# EAGLE design USB Power Distribution (EAGLE 9.4.2)
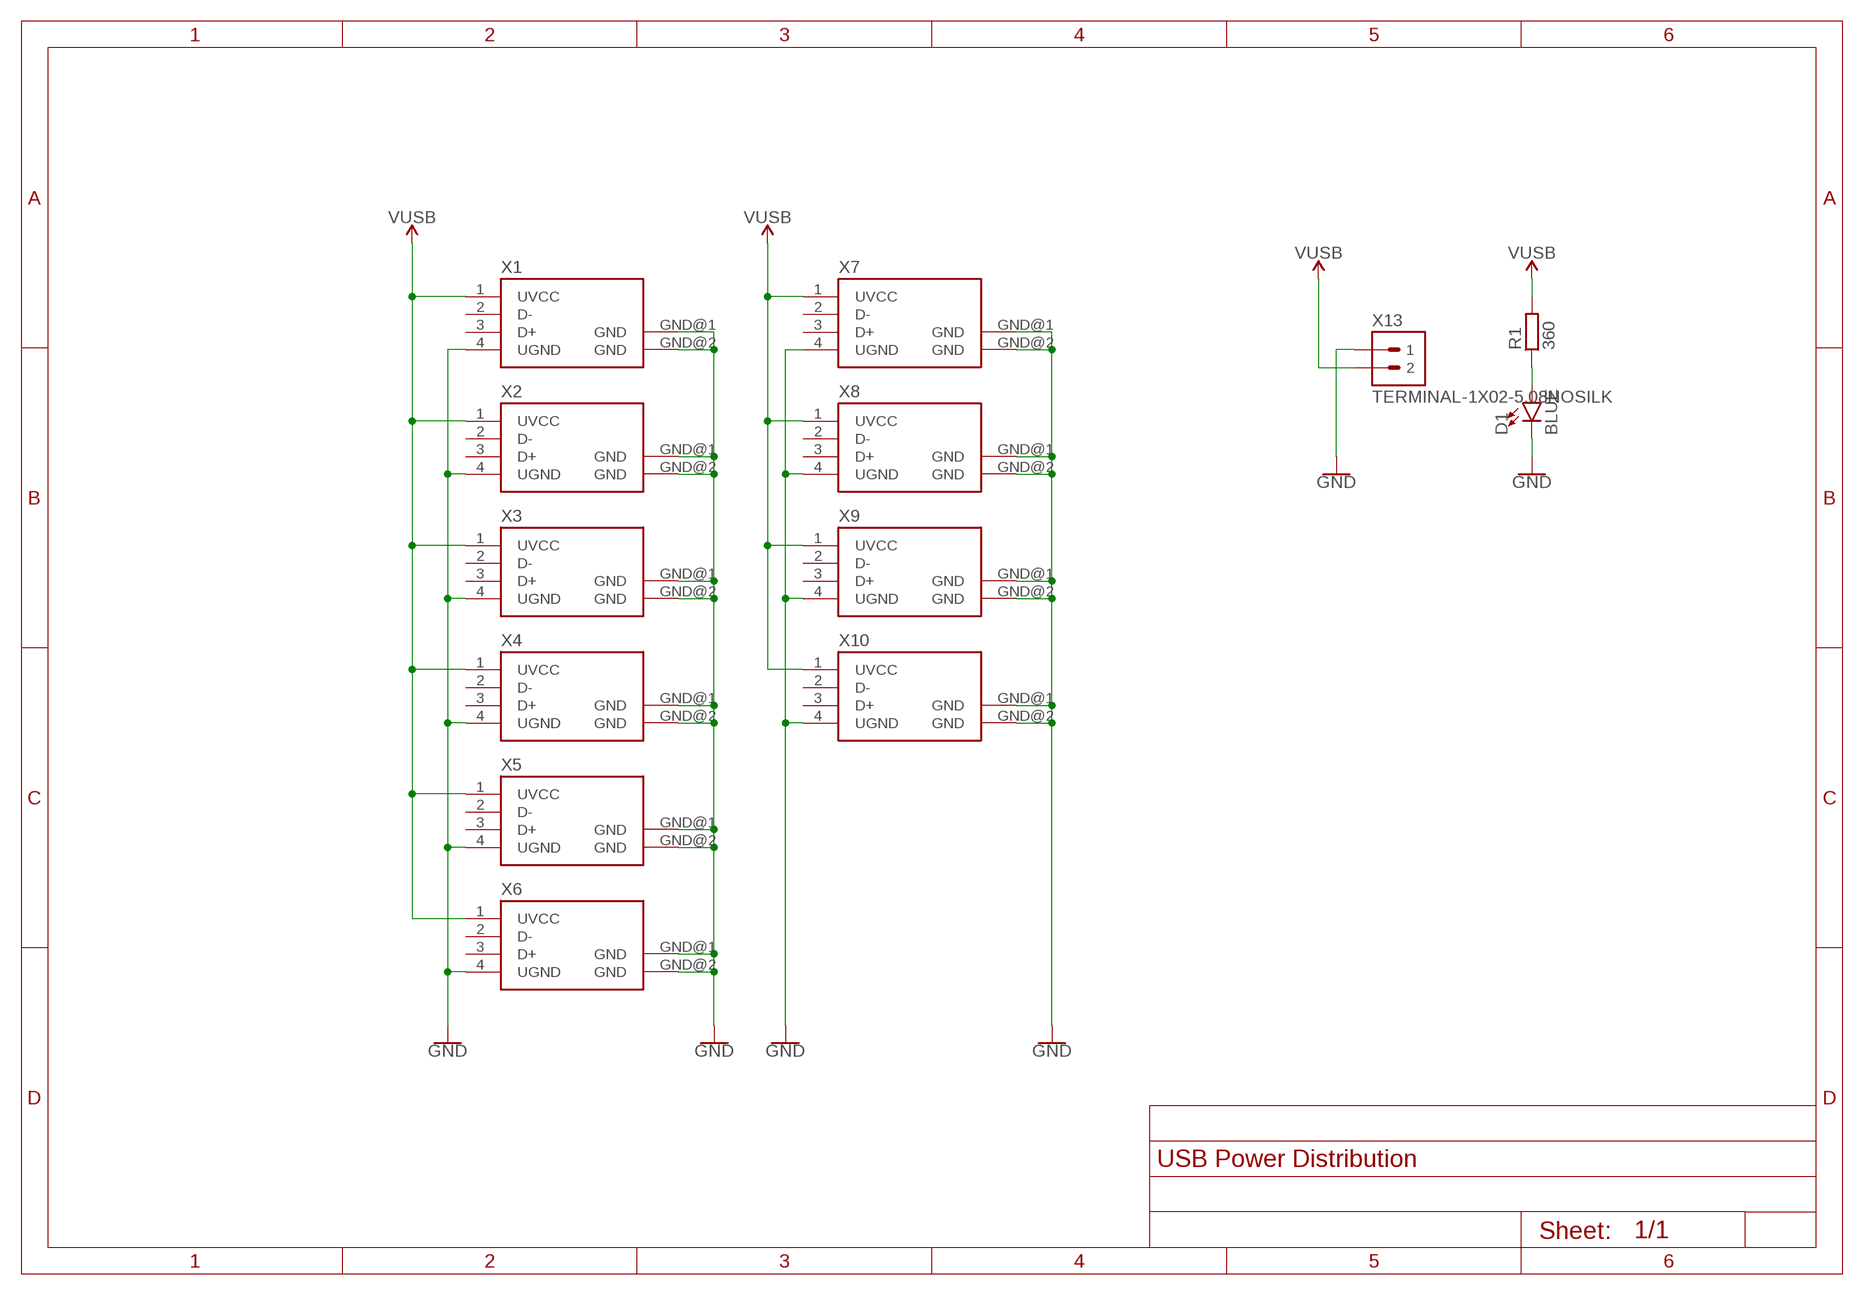
[diagram p0: schematic, sheet 1]

## Parts
D1  BLUE  LED3MM  [LED3MM]
R1  360  RESISTOR0805  [R0805]
X1  USB-AVERT-SS-52100-002  [USB-A-VERT-SS-52100-002]
X2  USB-AVERT-SS-52100-002  [USB-A-VERT-SS-52100-002]
X3  USB-AVERT-SS-52100-002  [USB-A-VERT-SS-52100-002]
X4  USB-AVERT-SS-52100-002  [USB-A-VERT-SS-52100-002]
X5  USB-AVERT-SS-52100-002  [USB-A-VERT-SS-52100-002]
X6  USB-AVERT-SS-52100-002  [USB-A-VERT-SS-52100-002]
X7  USB-AVERT-SS-52100-002  [USB-A-VERT-SS-52100-002]
X8  USB-AVERT-SS-52100-002  [USB-A-VERT-SS-52100-002]
X9  USB-AVERT-SS-52100-002  [USB-A-VERT-SS-52100-002]
X10  USB-AVERT-SS-52100-002  [USB-A-VERT-SS-52100-002]
X13  TERMINAL-1X02-5.08NOSILK  [TERMINAL-5.08-2P-NO-SILK]

## Nets
GND: D1.K(C) X1.4(UGND) X1.GND@1(GND) X1.GND@2(GND) X2.4(UGND) X2.GND@1(GND) X2.GND@2(GND) X3.4(UGND) X3.GND@1(GND) X3.GND@2(GND) X4.4(UGND) X4.GND@1(GND) X4.GND@2(GND) X5.4(UGND) X5.GND@1(GND) X5.GND@2(GND) X6.4(UGND) X6.GND@1(GND) X6.GND@2(GND) X7.4(UGND) X7.GND@1(GND) X7.GND@2(GND) X8.4(UGND) X8.GND@1(GND) X8.GND@2(GND) X9.4(UGND) X9.GND@1(GND) X9.GND@2(GND) X10.4(UGND) X10.GND@1(GND) X10.GND@2(GND) X13.P$1
N$1: D1.A R1.1
VUSB: R1.2 X1.1(UVCC) X2.1(UVCC) X3.1(UVCC) X4.1(UVCC) X5.1(UVCC) X6.1(UVCC) X7.1(UVCC) X8.1(UVCC) X9.1(UVCC) X10.1(UVCC) X13.P$2
Unconnected: X1.2(D-) X1.3(D+) X2.2(D-) X2.3(D+) X3.2(D-) X3.3(D+) X4.2(D-) X4.3(D+) X5.2(D-) X5.3(D+) X6.2(D-) X6.3(D+) X7.2(D-) X7.3(D+) X8.2(D-) X8.3(D+) X9.2(D-) X9.3(D+) X10.2(D-) X10.3(D+)

## Library data of the parts
D1 = M2M-LED:LED: LED (Generic) Standard schematic elements and footprints for 5mm, 3mm, 1206, and 0603 sized LEDs. Generic LEDs with no color specified.
R1 = M2M-Passives:RESISTOR
X1-X10 = M2M-Connectors:USB-A
X13 = M2M-Connectors:TERMINAL-1X02-5.08

## Board
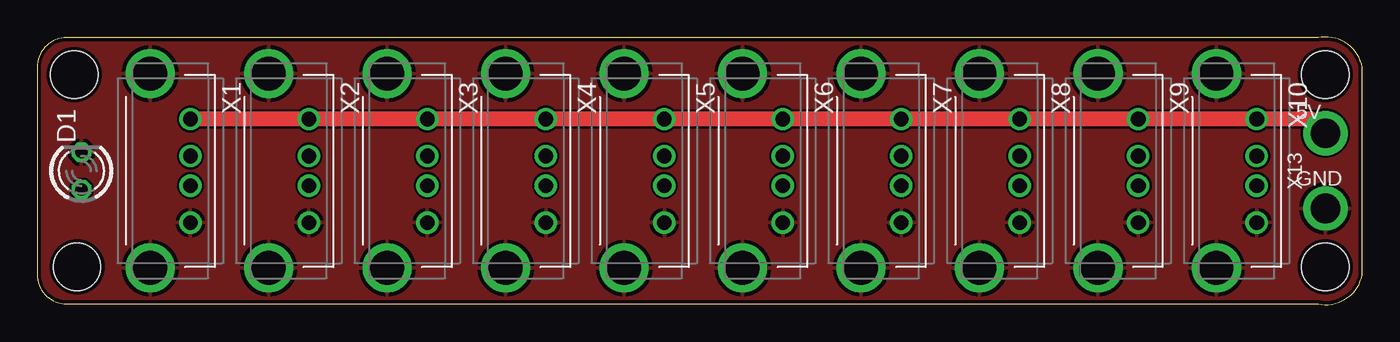
[diagram p1: board, top side]
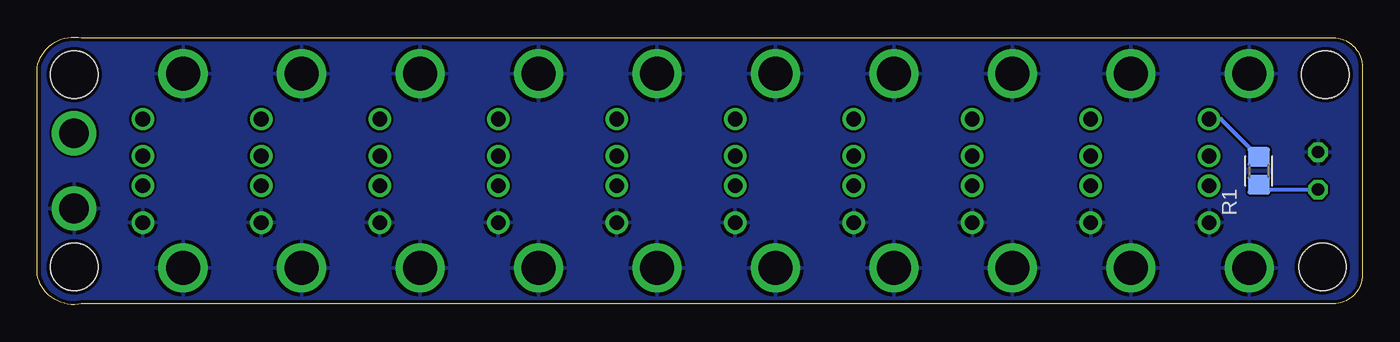
[diagram p2: board, bottom side, seen from below]

Size 89.5 x 18.1 mm. Coordinates in mm from the lower left corner, seen from the top.
Outline: 86.5,18.05 2,18.05 arc90 0,16.05 0,2.05 arc90 2,0.05 86.5,0.05 arc90 89.5,2.05 89.5,16.05 arc90 86.5,18.05
Copper layers (1*16): Top 0.035mm / dielectric 1.5mm / Bottom 0.035mm
Design rules "SeeedStudio_2layer_DRU_no_angle_20140221": minimum track width 6mil, minimum drill 12mil, track to track 6mil, track to pad 6mil, pad to pad 6mil, via to via 6mil, smd to smd 0mil, copper to edge 10mil, drill to drill 10mil, minimum pad ring 10mil, minimum via ring 6mil, stop-mask expansion 2mil, vias tented up to drill 100mil, thermal gap 10mil
Holes 3.2 mm at 2.5,15.55 2.7,2.55 87,15.55 87,2.55

### Footprints (pad centres in the part's own frame; a part is rotated, then mirrored left to right if it is on the bottom)
LED3MM = drill 0.813 octagon: A -1.27,0; K 1.27,0
R0805 = smd 1.3 x 1.5: 1 -0.95,0; 2 0.95,0
USB-A-VERT-SS-52100-002 = drill 1: 1 -3.5,1.355; 2 -1,1.355; 3 1,1.355; 4 3.5,1.355 | drill 2.3: GND@1 -6.57,-1.355; GND@2 6.57,-1.355
TERMINAL-5.08-2P-NO-SILK = drill 2: P$1 -2.54,0; P$2 2.54,0

### Placement (x,y rotation side)
D1  3,9.05 90 top
R1  7,9.05 90 bottom
X1  9,9.05 270 top
X2  17,9.05 270 top
X3  25,9.05 270 top
X4  33,9.05 270 top
X5  41,9.05 270 top
X6  49,9.05 270 top
X7  57,9.05 270 top
X8  65,9.05 270 top
X9  73,9.05 270 top
X10  81,9.05 270 top
X13  87,9.05 90 top

### Tracks (layer width: path | path; a pad name or v marks a point on that pad's centre or on a via)
GND
  pour Top: 0,0.05 89.5,0.05 89.5,18.05 0,18.05
  pour Bottom: 0,0.05 89.5,0.05 89.5,18.05 0,18.05
N$1
  Bottom 0.254: R1.1 6.68,7.78 D1.A
VUSB
  Top 1.016: X1.1 X2.1 X3.1 X4.1 X5.1 X6.1 X7.1 X8.1 X9.1 X10.1 86.04,12.55 X13.P$2
  Bottom 0.254: X1.1 9.55,12.55 R1.2

### Text on the board
tPlace: 5V | GND